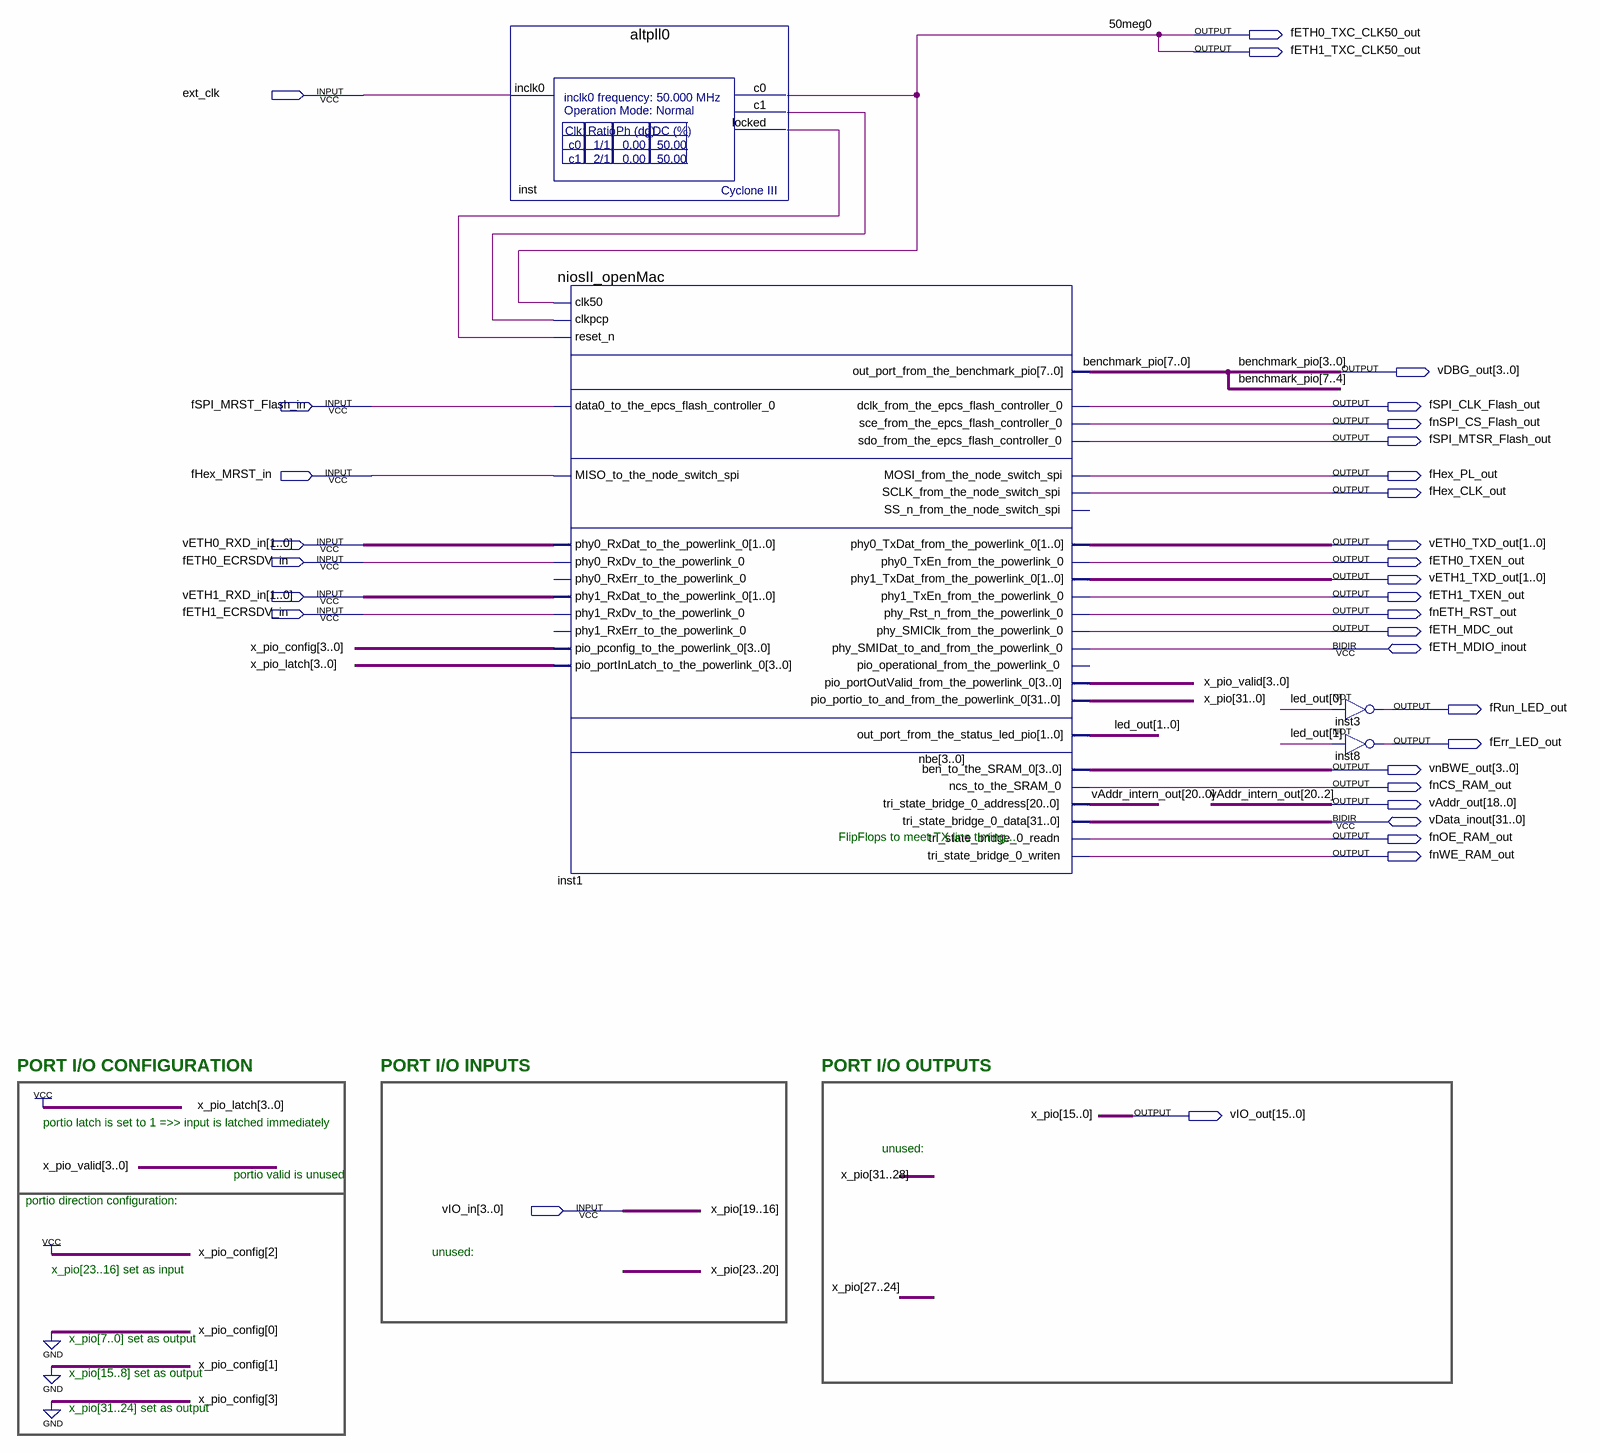
[diagram p0: schematic sheet]
// Quartus schematic nios_pll.bdf as structural Verilog: 4 symbols, 32 pins
module nios_pll (
  input  ext_clk,
  input  fSPI_MRST_Flash_in,
  input  fHex_MRST_in,
  input  [1:0] vETH0_RXD_in,
  input  fETH0_ECRSDV_in,
  input  [1:0] vETH1_RXD_in,
  input  fETH1_ECRSDV_in,
  input  [3:0] vIO_in,
  inout  fETH_MDIO_inout,
  inout  [31:0] vData_inout,
  output fETH0_TXC_CLK50_out,
  output fETH1_TXC_CLK50_out,
  output [3:0] vDBG_out,
  output fSPI_CLK_Flash_out,
  output fnSPI_CS_Flash_out,
  output fSPI_MTSR_Flash_out,
  output fHex_PL_out,
  output fHex_CLK_out,
  output [1:0] vETH0_TXD_out,
  output fETH0_TXEN_out,
  output [1:0] vETH1_TXD_out,
  output fETH1_TXEN_out,
  output fnETH_RST_out,
  output fETH_MDC_out,
  output fRun_LED_out,
  output fErr_LED_out,
  output [3:0] vnBWE_out,
  output fnCS_RAM_out,
  output [18:0] vAddr_out,
  output fnOE_RAM_out,
  output fnWE_RAM_out,
  output [15:0] vIO_out
);

  wire inst_c1, inst_locked;
  wire [1:0] led_out, vAddr_intern_out;
  wire [3:0] x_pio_valid;
  wire [7:4] benchmark_pio;
  wire [31:20] x_pio;

  altpll0 inst (.inclk0(ext_clk), .c0(fETH0_TXC_CLK50_out), .c1(inst_c1), .locked(inst_locked));
  niosII_openMac inst1 (
    .clk50(fETH0_TXC_CLK50_out), .clkpcp(inst_c1), .reset_n(inst_locked),
    .data0_to_the_epcs_flash_controller_0(fSPI_MRST_Flash_in), .MISO_to_the_node_switch_spi(fHex_MRST_in),
    .phy0_RxDat_to_the_powerlink_0(vETH0_RXD_in), .phy0_RxDv_to_the_powerlink_0(fETH0_ECRSDV_in),
    .phy1_RxDat_to_the_powerlink_0(vETH1_RXD_in), .phy1_RxDv_to_the_powerlink_0(fETH1_ECRSDV_in),
    .pio_pconfig_to_the_powerlink_0(4'b0100), .pio_portInLatch_to_the_powerlink_0(4'b1111),
    .out_port_from_the_benchmark_pio({benchmark_pio, vDBG_out}),
    .dclk_from_the_epcs_flash_controller_0(fSPI_CLK_Flash_out),
    .sce_from_the_epcs_flash_controller_0(fnSPI_CS_Flash_out),
    .sdo_from_the_epcs_flash_controller_0(fSPI_MTSR_Flash_out), .MOSI_from_the_node_switch_spi(fHex_PL_out),
    .SCLK_from_the_node_switch_spi(fHex_CLK_out), .phy0_TxDat_from_the_powerlink_0(vETH0_TXD_out),
    .phy0_TxEn_from_the_powerlink_0(fETH0_TXEN_out), .phy1_TxDat_from_the_powerlink_0(vETH1_TXD_out),
    .phy1_TxEn_from_the_powerlink_0(fETH1_TXEN_out), .phy_Rst_n_from_the_powerlink_0(fnETH_RST_out),
    .phy_SMIClk_from_the_powerlink_0(fETH_MDC_out), .pio_portOutValid_from_the_powerlink_0(x_pio_valid),
    .out_port_from_the_status_led_pio(led_out), .ben_to_the_SRAM_0(vnBWE_out),
    .ncs_to_the_SRAM_0(fnCS_RAM_out), .tri_state_bridge_0_address({vAddr_out, vAddr_intern_out}),
    .tri_state_bridge_0_readn(fnOE_RAM_out), .tri_state_bridge_0_writen(fnWE_RAM_out),
    .phy_SMIDat_to_and_from_the_powerlink_0(fETH_MDIO_inout),
    .pio_portio_to_and_from_the_powerlink_0({x_pio, vIO_in, vIO_out}), .tri_state_bridge_0_data(vData_inout));  // open: phy0_RxErr_to_the_powerlink_0, phy1_RxErr_to_the_powerlink_0, SS_n_from_the_node_switch_spi, pio_operational_from_the_powerlink_0
  not inst3 (fRun_LED_out, led_out[0]);
  not inst8 (fErr_LED_out, led_out[1]);

  assign fETH1_TXC_CLK50_out = fETH0_TXC_CLK50_out;

  // Other names for the same wires on the sheet: benchmark_pio[3:0] = vDBG_out; 50meg0 = fETH0_TXC_CLK50_out;
  //   nbe[3:0] = vnBWE_out; vAddr_intern_out[20:2] = vAddr_out; x_pio[19:0] = {vIO_in, vIO_out}

  // Notes on the sheet:
  //   FlipFlops to meet TX line timing...
  //   PORT I/O CONFIGURATION
  //   PORT I/O INPUTS
  //   PORT I/O OUTPUTS
  //   portio latch is set to 1 =>> input is latched immediately
  //   unused:
  //   portio valid is unused
  //   portio direction configuration:
  //   unused:
  //   x_pio[23..16] set as input
  //   x_pio[7..0] set as output
  //   x_pio[15..8] set as output
  //   x_pio[31..24] set as output
endmodule
